# Altium project LimeSDR-USB_1v4.PrjPcb (part 1 of 8)
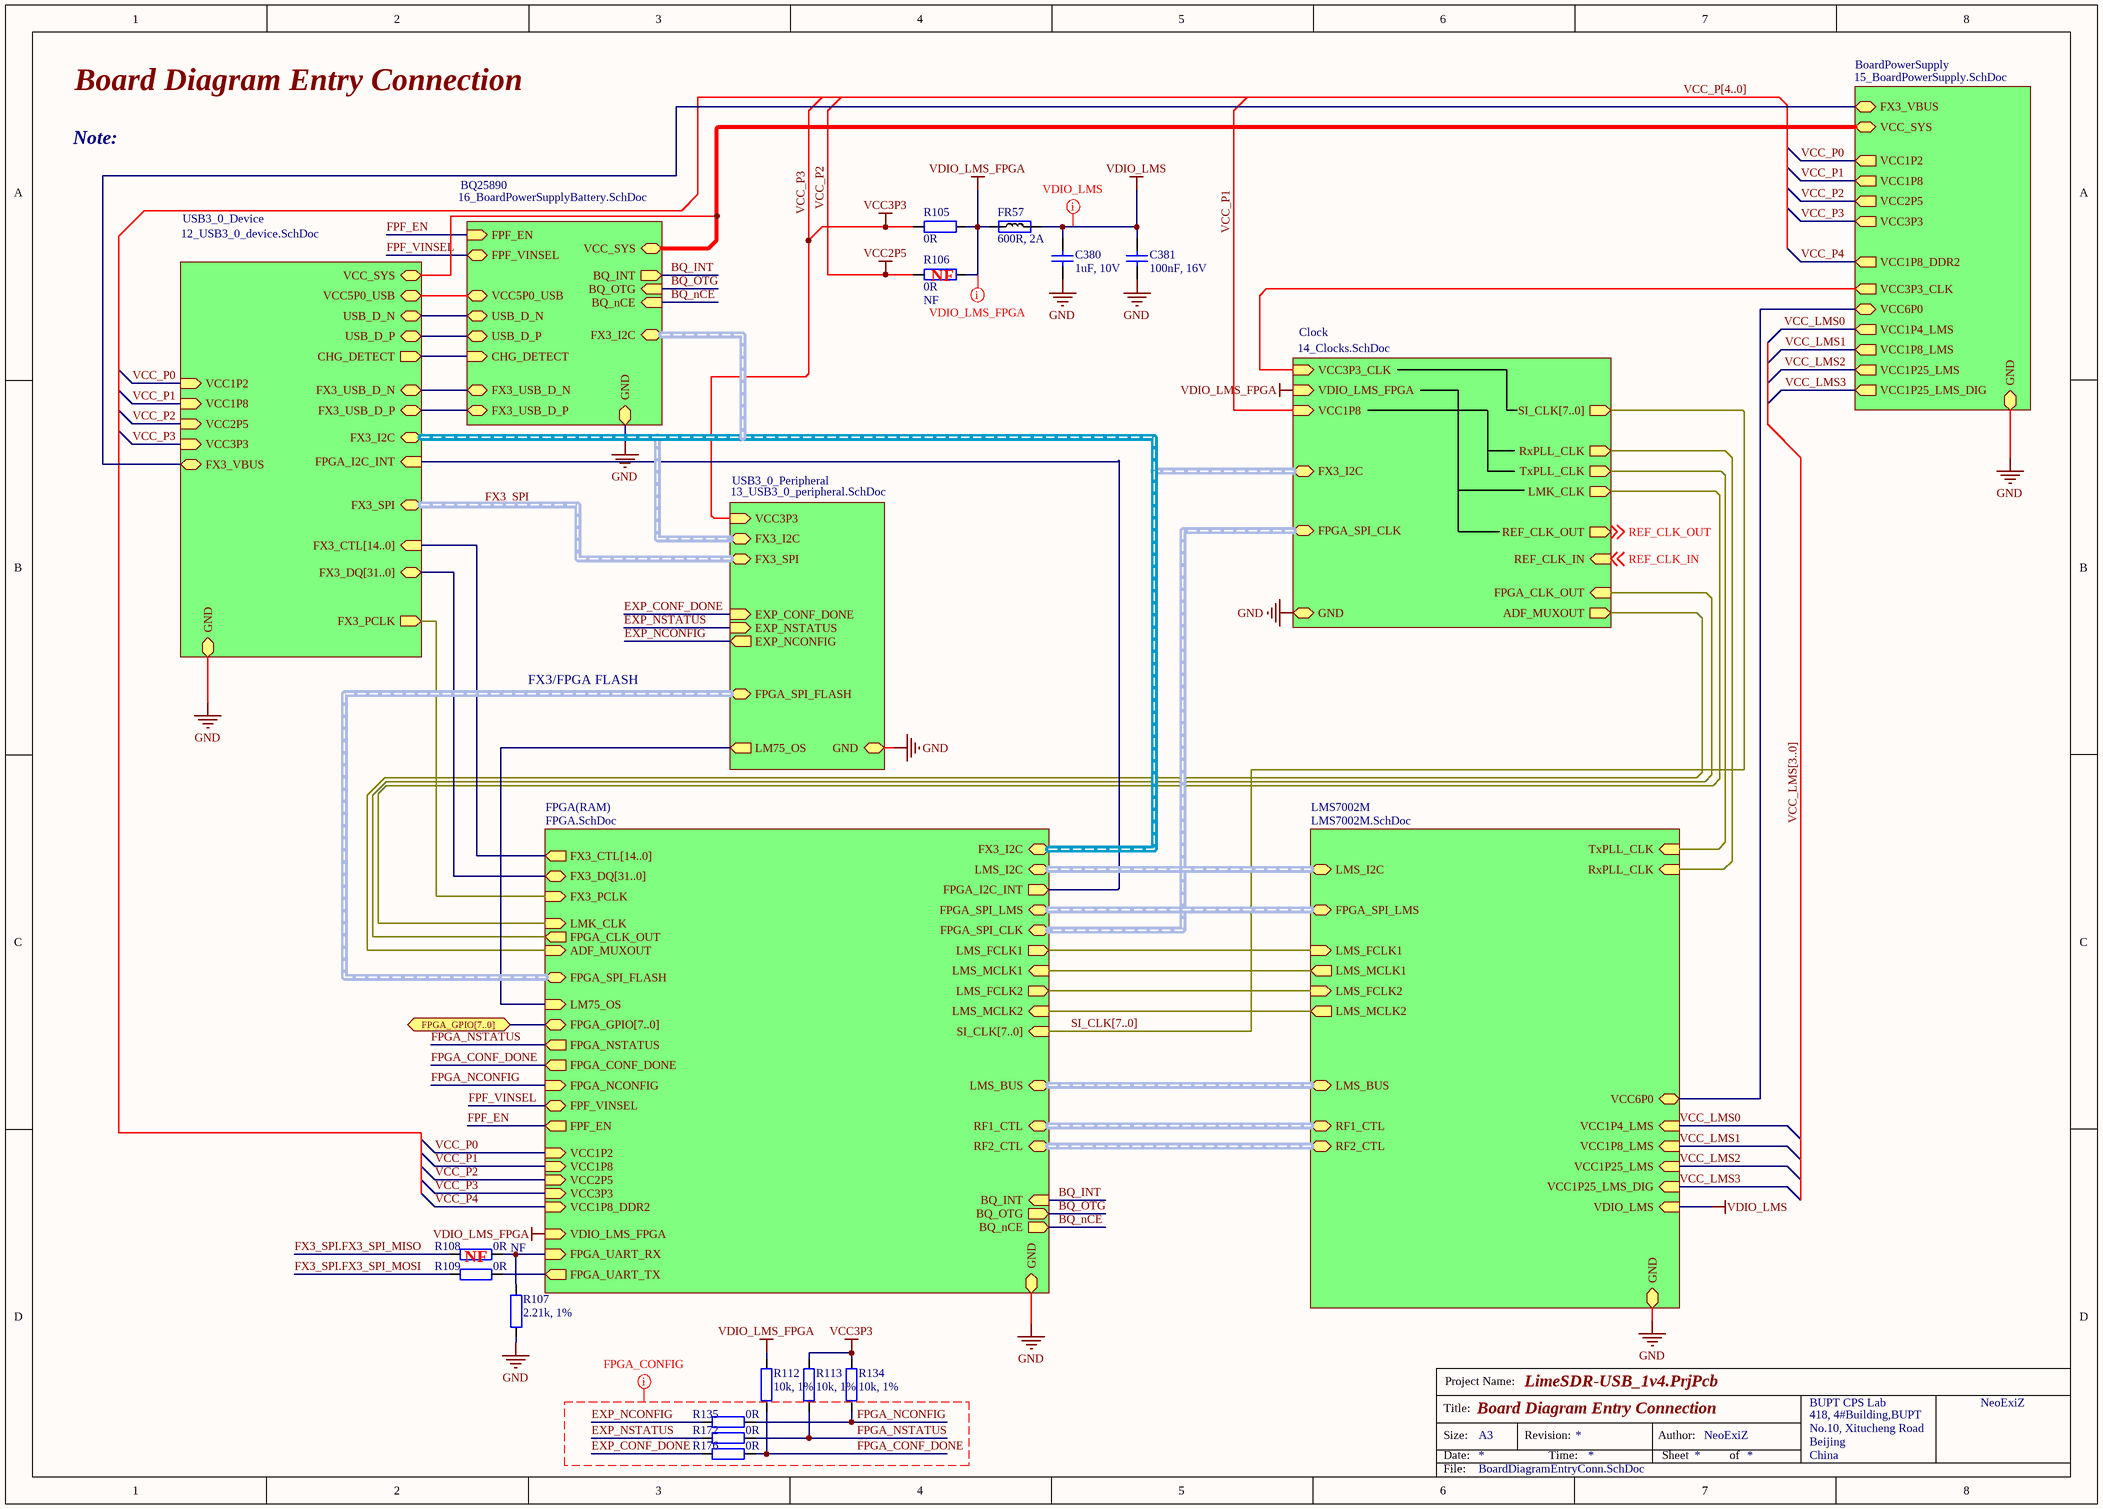
[diagram p0: BoardDiagramEntryConn.SchDoc]
15 sheets, 808 parts. Net scope: strictly hierarchical (ports join the sheet entries above them; power ports are local).
Board files: LimeSDR-USB_1v4.PcbDoc, LimeSDR-USB_1v5.PcbDoc
Sheets:
  BoardDiagramEntryConn.SchDoc
    BoardPowerSupply = 15_BoardPowerSupply.SchDoc
    BQ25890 = 16_BoardPowerSupplyBattery.SchDoc
    Clock = 14_Clocks.SchDoc
    USB3_0_Device = 12_USB3_0_device.SchDoc
    USB3_0_Peripheral = 13_USB3_0_peripheral.SchDoc
    FPGA(RAM) = FPGA.SchDoc
      FPGA_C = 09_FPGA_banks_5_6_7_8.SchDoc
      FPGA_B = 08_FPGA_banks_1_2_3_4.SchDoc
      FPGA_A = 10_FPGA_misc.SchDoc
      DDR2 = 11_DDR2.SchDoc
    LMS7002M = LMS7002M.SchDoc
      LMS7002M_Misc = LMS7002M_Misc.SchDoc
      LMS7002M_RF1 = LMS7002M_RF1.SchDoc
      LMS7002M_RF2 = LMS7002M_RF2.SchDoc

## Sheet BoardDiagramEntryConn.SchDoc: Board Diagram Entry Connection
size A3; Author: NeoExiZ; CompanyName: BUPT CPS Lab; Engineer: NeoExiZ; Organization: NeoExiZ; Address1: 418, 4#Building,BUPT; Address2: No.10, Xitucheng Road; Address3: Beijing; Address4: China

### Parts
C380  1uF, 10V  [CAP0402]
C381  100nF, 16V  [CAP0402]
FR57  600R, 2A  [RES0805]
R105  0R  [RES0402]
R106  0R  Assembly Info: NF  [RES0402]
R107  2.21k, 1%  [RES0402]
R108  0R  Assembly Info: NF  [RES0402]
R109  0R  [RES0402]
R112  10k, 1%  [RES0402]
R113  10k, 1%  [RES0402]
R134  10k, 1%  [RES0402]
R135  0R  [RES0402]
R172  0R  [RES0402]
R176  0R  [RES0402]

### Sub-sheets
BoardPowerSupply = 15_BoardPowerSupply.SchDoc: VCC3P3 (out), VCC2P5 (out), VCC1P2 (out), VCC3P3_CLK (out), VCC1P4_LMS (out), VCC1P8_LMS (out), VCC1P25_LMS (out), VCC1P25_LMS_DIG (out), VCC1P8 (out), VCC1P8_DDR2 (out), VCC_SYS, GND, FX3_VBUS, VCC6P0
BQ25890 = 16_BoardPowerSupplyBattery.SchDoc: VCC5P0_USB, FX3_USB_D_N (bidir), FX3_USB_D_P (bidir), USB_D_N (bidir), USB_D_P (bidir), VCC_SYS, FPF_VINSEL (bidir), GND, BQ_nCE (in), BQ_INT (out), BQ_OTG (in), CHG_DETECT (in), FPF_EN (in), FX3_I2C (harness FX3_I2C)
Clock = 14_Clocks.SchDoc: VDIO_LMS_FPGA (in), VCC3P3_CLK (in), VCC1P8 (in), REF_CLK_IN (in), REF_CLK_OUT (out), SI_CLK[7..0] (out), RxPLL_CLK (out), TxPLL_CLK (out), FPGA_CLK_OUT (in), LMK_CLK (out), ADF_MUXOUT (out), GND, FPGA_SPI_CLK (harness FPGA_SPI_CLK), FX3_I2C (harness FX3_I2C)
FPGA(RAM) = FPGA.SchDoc: SI_CLK[7..0] (in), FX3_DQ[31..0] (bidir), FX3_PCLK (in), FX3_CTL[14..0] (out, harness FX3_SPI), LMS_MCLK1 (in), LMS_MCLK2 (in), FPGA_NSTATUS (out), FPGA_CONF_DONE (out), FPGA_NCONFIG (in), LMS_FCLK1 (out), LMS_FCLK2 (out), FPGA_I2C_INT (out), LMK_CLK (in), FPGA_CLK_OUT (out), LM75_OS (in), FPGA_GPIO[7..0] (bidir), VCC1P2 (in), VCC1P8 (in), VCC3P3 (in), VDIO_LMS_FPGA (in), VCC2P5 (in), FPGA_UART_RX (in), FPGA_UART_TX (out), ADF_MUXOUT (in), VCC1P8_DDR2 (in), FPF_VINSEL (bidir), GND, BQ_INT (in), BQ_OTG (out), BQ_nCE (out), FPF_EN (out), FPGA_SPI_CLK (harness FPGA_SPI_CLK), FX3_I2C (harness FX3_I2C), FPGA_SPI_FLASH (harness FPGA_SPI_FLASH), FPGA_SPI_LMS (harness FPGA_SPI_LMS), LMS_I2C (harness I2C), LMS_BUS (harness LMS_BUS), RF1_CTL (harness RF_CTL), RF2_CTL (harness RF_CTL)
LMS7002M = LMS7002M.SchDoc: FPGA_SPI_LMS (harness FPGA_SPI_LMS), LMS_FCLK1 (in), LMS_FCLK2 (in), LMS_MCLK1 (out), LMS_MCLK2 (out), RxPLL_CLK (in), TxPLL_CLK (in), VCC1P4_LMS (in), VCC1P8_LMS (in), VCC1P25_LMS (in), VCC1P25_LMS_DIG (in), VDIO_LMS (in), GND, LMS_I2C (harness I2C), LMS_BUS (harness LMS_BUS), RF1_CTL (harness RF_CTL), RF2_CTL (harness RF_CTL), VCC6P0
USB3_0_Device = 12_USB3_0_device.SchDoc: VCC1P2 (in), VCC1P8 (in), VCC2P5 (in), VCC3P3 (in), FX3_CTL[14..0] (in, harness FX3_SPI), FX3_DQ[31..0] (bidir), FX3_PCLK (out), FX3_USB_D_N (bidir), FX3_USB_D_P (bidir), VCC5P0_USB, USB_D_N (bidir), USB_D_P (bidir), GND, VCC_SYS, CHG_DETECT (out), FPGA_I2C_INT (in), FX3_I2C (harness FX3_I2C), FX3_SPI (harness FX3_SPI), FX3_VBUS
USB3_0_Peripheral = 13_USB3_0_peripheral.SchDoc: EXP_NCONFIG (out), EXP_NSTATUS (in), EXP_CONF_DONE (in), LM75_OS (out), VCC3P3 (in), GND, FX3_I2C (harness FX3_I2C), FPGA_SPI_FLASH (harness FPGA_SPI_FLASH), FX3_SPI (harness FX3_SPI)

### Ports
FPGA_GPIO[7..0] (bidir)

### Nets
GND: C380.1 C381.2 R107.1 ; sheet BoardPowerSupply/GND, sheet BQ25890/GND, sheet Clock/GND, sheet USB3_0_Device/GND, sheet USB3_0_Peripheral/GND, sheet FPGA(RAM)/GND, sheet LMS7002M/GND
VCC3P3_CLK: sheet BoardPowerSupply/VCC3P3_CLK, sheet Clock/VCC3P3_CLK
VCC5P0_USB: sheet BQ25890/VCC5P0_USB, sheet USB3_0_Device/VCC5P0_USB
VCC6P0: sheet BoardPowerSupply/VCC6P0, sheet LMS7002M/VCC6P0
VCC_LMS1: sheet BoardPowerSupply/VCC1P8_LMS, sheet LMS7002M/VCC1P8_LMS
VCC_P0: sheet BoardPowerSupply/VCC1P2, sheet USB3_0_Device/VCC1P2, sheet FPGA(RAM)/VCC1P2
VCC_P2: R106.2 ; sheet BoardPowerSupply/VCC2P5, sheet USB3_0_Device/VCC2P5, sheet FPGA(RAM)/VCC2P5  [also labelled VCC2P5]
VCC_P3: R105.2 R113.1 R134.1 ; sheet BoardPowerSupply/VCC3P3, sheet USB3_0_Device/VCC3P3, sheet USB3_0_Peripheral/VCC3P3, sheet FPGA(RAM)/VCC3P3  [also labelled VCC3P3]
VCC_SYS: sheet BoardPowerSupply/VCC_SYS, sheet BQ25890/VCC_SYS, sheet USB3_0_Device/VCC_SYS
VDIO_LMS: C380.2 C381.1 FR57.2 ; sheet LMS7002M/VDIO_LMS
VDIO_LMS_FPGA: FR57.1 R105.1 R106.1 R112.1 ; sheet Clock/VDIO_LMS_FPGA, sheet FPGA(RAM)/VDIO_LMS_FPGA
BQ_INT: sheet BQ25890/BQ_INT, sheet FPGA(RAM)/BQ_INT
BQ_nCE: sheet BQ25890/BQ_nCE, sheet BQ25890/CHG_DETECT, sheet USB3_0_Device/CHG_DETECT, sheet FPGA(RAM)/BQ_nCE
BQ_OTG: sheet BQ25890/BQ_OTG, sheet FPGA(RAM)/BQ_OTG
EXP_CONF_DONE: R176.1 ; sheet USB3_0_Peripheral/EXP_CONF_DONE
EXP_NCONFIG: R135.1 ; sheet USB3_0_Peripheral/EXP_NCONFIG
EXP_NSTATUS: R172.1 ; sheet USB3_0_Peripheral/EXP_NSTATUS
FPF_EN: sheet BQ25890/FPF_EN, sheet FPGA(RAM)/FPF_EN
FPF_VINSEL: sheet BQ25890/FPF_VINSEL, sheet FPGA(RAM)/FPF_VINSEL
FPGA_CONF_DONE: R112.2 R176.2 ; sheet FPGA(RAM)/FPGA_CONF_DONE
FPGA_NCONFIG: R134.2 R135.2 ; sheet FPGA(RAM)/FPGA_NCONFIG
FPGA_NSTATUS: R113.2 R172.2 ; sheet FPGA(RAM)/FPGA_NSTATUS
FX3_PCLK: sheet USB3_0_Device/FX3_PCLK, sheet FPGA(RAM)/FX3_PCLK
FX3_SPI.FX3_SPI_MISO: R108.1
FX3_SPI.FX3_SPI_MOSI: R109.1
FX3_USB_D_N: sheet BQ25890/FX3_USB_D_N, sheet USB3_0_Device/FX3_USB_D_N
FX3_USB_D_P: sheet BQ25890/FX3_USB_D_P, sheet USB3_0_Device/FX3_USB_D_P
FX3_VBUS: sheet BoardPowerSupply/FX3_VBUS, sheet USB3_0_Device/FX3_VBUS
LM75_OS: sheet USB3_0_Peripheral/LM75_OS, sheet FPGA(RAM)/LM75_OS
LMK_CLK: sheet Clock/LMK_CLK, sheet FPGA(RAM)/LMK_CLK
LMS_FCLK1: sheet FPGA(RAM)/LMS_FCLK1, sheet LMS7002M/LMS_FCLK1
LMS_FCLK2: sheet FPGA(RAM)/LMS_FCLK2, sheet LMS7002M/LMS_FCLK2
LMS_MCLK1: sheet FPGA(RAM)/LMS_MCLK1, sheet LMS7002M/LMS_MCLK1
LMS_MCLK2: sheet FPGA(RAM)/LMS_MCLK2, sheet LMS7002M/LMS_MCLK2
REF_CLK_IN: off-sheet REF_CLK_IN, sheet Clock/REF_CLK_IN
REF_CLK_OUT: off-sheet REF_CLK_OUT, sheet Clock/REF_CLK_OUT
RxPLL_CLK: sheet Clock/RxPLL_CLK, sheet LMS7002M/RxPLL_CLK
TxPLL_CLK: sheet Clock/TxPLL_CLK, sheet LMS7002M/TxPLL_CLK
USB_D_N: sheet BQ25890/USB_D_N, sheet USB3_0_Device/USB_D_N
USB_D_P: sheet BQ25890/USB_D_P, sheet USB3_0_Device/USB_D_P
VCC_LMS0: sheet BoardPowerSupply/VCC1P4_LMS, sheet LMS7002M/VCC1P4_LMS
VCC_LMS2: sheet BoardPowerSupply/VCC1P25_LMS, sheet LMS7002M/VCC1P25_LMS
VCC_LMS3: sheet BoardPowerSupply/VCC1P25_LMS_DIG, sheet LMS7002M/VCC1P25_LMS_DIG
VCC_P1: sheet BoardPowerSupply/VCC1P8, sheet Clock/VCC1P8, sheet USB3_0_Device/VCC1P8, sheet FPGA(RAM)/VCC1P8  [project net VCC1P8]
VCC_P4: sheet BoardPowerSupply/VCC1P8_DDR2, sheet FPGA(RAM)/VCC1P8_DDR2
NetIC8_C2: sheet Clock/FPGA_CLK_OUT, sheet FPGA(RAM)/FPGA_CLK_OUT
NetIC8_J1: R107.2 R108.2 ; sheet FPGA(RAM)/FPGA_UART_RX
NetIC8_J2: sheet Clock/ADF_MUXOUT, sheet FPGA(RAM)/ADF_MUXOUT
NetIC8_J8: R109.2 ; sheet FPGA(RAM)/FPGA_UART_TX
NetIC8_R1: sheet USB3_0_Device/FPGA_I2C_INT, sheet FPGA(RAM)/FPGA_I2C_INT

### Buses and harness runs
bus port FPGA_GPIO[7..0] = sheet FPGA(RAM)/FPGA_GPIO[7..0]
bus sheet FPGA(RAM)/FX3_DQ[31..0] = sheet USB3_0_Device/FX3_DQ[31..0]
bus SI_CLK[7..0] = sheet Clock/SI_CLK[7..0] = sheet FPGA(RAM)/SI_CLK[7..0]
bus VCC_LMS[3..0]
bus VCC_P[4..0]
harness FX3_SPI = sheet USB3_0_Device/FX3_SPI = sheet USB3_0_Peripheral/FX3_SPI
harness sheet BQ25890/FX3_I2C = sheet Clock/FX3_I2C = sheet FPGA(RAM)/FX3_I2C = sheet USB3_0_Device/FX3_I2C = sheet USB3_0_Peripheral/FX3_I2C
harness sheet Clock/FPGA_SPI_CLK = sheet FPGA(RAM)/FPGA_SPI_CLK
harness sheet FPGA(RAM)/FPGA_SPI_FLASH = sheet USB3_0_Peripheral/FPGA_SPI_FLASH
harness sheet FPGA(RAM)/FPGA_SPI_LMS = sheet LMS7002M/FPGA_SPI_LMS
harness sheet FPGA(RAM)/LMS_BUS = sheet LMS7002M/LMS_BUS
harness sheet FPGA(RAM)/LMS_I2C = sheet LMS7002M/LMS_I2C
harness sheet FPGA(RAM)/RF1_CTL = sheet LMS7002M/RF1_CTL
harness sheet FPGA(RAM)/RF2_CTL = sheet LMS7002M/RF2_CTL

### Layout directives
net class FPGA_CONFIG: EXP_CONF_DONE, EXP_NCONFIG, EXP_NSTATUS, FPGA_CONF_DONE, FPGA_NCONFIG, FPGA_NSTATUS
net class VDIO_LMS: VDIO_LMS
net class VDIO_LMS_FPGA: VDIO_LMS_FPGA

### Notes on the sheet
- (near R106) NF
- FX3/FPGA FLASH
- (near R108) NF
- Note:
- Project Name:
- Size:
- Date:
- Title:
- A3
- Revision:
- Time:
- Author:
- Sheet
- of
- File:

### Library data of the parts
C380 = Cap_0402: Manufacturer Part Number 1: GRM155R61A105KE15J; Manufacturer: TDK; Part Description: 1µF ±10% 10V X5R Ceramic Capacitor -55°C ~ 85°C Surface Mount, MLCC 0402 (1005 Metric) 0.039" L x 0.020" W (1.00mm x 0.50mm); Voltage Rating: 10; Capacitance Tolerance: ± 10%; Product Range: TDK - C Series; Ceramic Capacitor Case: 0402 [1005 Metric]; Capacitance: 1; Dielectric Characteristic: X6; Value: 1uF, 10V; Supplier 1: Newark; Supplier Part Number 1: 490-6298-2-ND; MSL: -; RoHS: YES
C381 = Cap_0402: Manufacturer: Murata Electronics; Manufacturer Part Number: GRM155R71C104KA88D; Part Description: 0.10µF ±10% 16V X7R Ceramic Capacitor -55°C ~ 125°C Surface Mount, MLCC 0402 (1005 Metric) 0.039" L x 0.020" W (1.00mm x 0.50mm); Tolerance: 10 %; Type: General Purpose MLCC; Capacitance: 0.1 uF; Case Length: 1 mm; Dielectric: X7R; Case Height: 0.5 mm; Temperature Coefficient / Code: +/- 15 %; Value: 100nF, 16V; Supplier 1: Mouser; Supplier Part Number 1: 81-GRM155R71C104KA88; Case Code - in: 0402; RoHS: RoHS Compliant; Operating Temperature Range: - 55 C to + 125 C; Series: GRM; Termination Style: SMD/SMT; Package / Case: 0402 (1005 metric); Voltage Rating DC: 16 V; Maximum Operating Temperature: + 125 C; Case Code - mm: 1005; Minimum Operating Temperature: - 55 C; Product Category: Low & Medium Capacitance SMD Ceramic Chip Capacitors; Packaging: Reel; Product: General Type MLCCs; Category: Multilayer Ceramic Capacitors MLCC - SMD/SMT; Brand: Murata Electronics; Case Width: 0.5 mm; RoHS - Mouser: Y; Standard Pack Qty: 10000; Minimum Order Quantity: 1; Reeling: True; Manufacturer Part Number 1: GRM155R71C104KA88D
FR57 = Ferrite: Manufacturer Part Number 1: MPZ2012S601AT000; Manufacturer: TDK Corporation; Part Description: FERRITE BEAD 600 OHM 0805 1LN; Filter Type: Differential Mode - Single; Impedance @ Frequency: 600 Ohm @ 100MHz; DC Resistance (DCR): 100 mOhm Max; Supplier 1: Digi-Key; Supplier Part Number 1: 445-2206-2-ND; Mounting Type: Surface Mount; RoHS: RoHS Compliant; Height (Max): 0.041" (1.05mm); Packaging: Tape & Reel (TR); Category: Filters; Current Rating: 2A; Package / Case: 0805 (2012 Metric); Size / Dimension: 0.079" L x 0.049" W (2.00mm x 1.25mm); Value: 600R, 2A
R105 R106 = Res_0402: Manufacturer Part Number 1: RC0402JR-070RL; Manufacturer: Yageo; Part Description: RES SMD 0.0OHM JUMPER 1/16W 0402; Resistance (Ohms): 0.0; Tolerance: Jumper; Power (Watts): 0.063W, 1/16W; Value: 0R; Supplier 1: Digi-Key; Supplier Part Number 1: 311-0.0JRTR-ND; Category: Resistors; Temperature Coefficient: -; Features: Moisture Resistant; Supplier Device Package: 0402; Height: 0.016" (0.40mm); Package / Case: 0402 (1005 Metric); Operating Temperature: -55°C ~ 155°C; Size / Dimension: 0.039" L x 0.020" W (1.00mm x 0.50mm); Composition: Thick Film; Packaging: Tape & Reel (TR); Number of Terminations: 2; RoHS: RoHS Compliant
R107 = Res_0402: Manufacturer: Stackpole Electronics Inc.; Manufacturer Part Number 1: RMCF0402FT2K21; Part Description: RES SMD 2.21K OHM 1% 1/16W 0402; Power (Watts): 0.063W, 1/16W; Temperature Coefficient: ±100ppm/°C; Value: 2.21k, 1%; Supplier 1: Digi-Key; Supplier Part Number 1: RMCF0402FT2K21CT-ND; Operating Temperature: -55°C ~ 155°C; Height: 0.016" (0.40mm); Tolerance: ±1%; Resistance (Ohms): 2.21k; Features: Automotive AEC-Q200; Package / Case: 0402 (1005 Metric); Packaging: Cut Tape (CT); Composition: Thick Film; Category: Resistors; Supplier Device Package: 0402; Number of Terminations: 2; RoHS: RoHS Compliant; Size / Dimension: 0.039" L x 0.020" W (1.00mm x 0.50mm)
R108 R109 R135 R172 R176 = Res_0402: Manufacturer: Yageo; Part Description: RES SMD 0.0OHM JUMPER 1/16W 0402; Supplier 1: Digi-Key; Supplier Part Number 1: 311-0.0JRTR-ND; Composition: Thick Film; Package / Case: 0402 (1005 Metric); Category: Resistors; Value: 0R
R112 R113 R134 = Res_0402: Manufacturer: Yageo; Manufacturer Part Number 1: RC0402FR-0710KL; Part Description: RES SMD 10K OHM 1% 1/16W 0402; Temperature Coefficient: ±100ppm/°C; Power (Watts): 0.063W, 1/16W; Value: 10k, 1%; Supplier 1: Digi-Key; Supplier Part Number 1: 311-10.0KLRTR-ND; Resistance (Ohms): 10k; Packaging: Tape & Reel (TR); RoHS: RoHS Compliant; Package / Case: 0402 (1005 Metric); Tolerance: ±1%; Operating Temperature: -55°C ~ 155°C; Size / Dimension: 0.039" L x 0.020" W (1.00mm x 0.50mm); Number of Terminations: 2; Category: Resistors; Height: 0.016" (0.40mm); Supplier Device Package: 0402; Features: Moisture Resistant; Composition: Thick Film

## Sheet 15_BoardPowerSupply.SchDoc: Board power supply
size A3; Organization: Lime Microsystems; Address1: Surrey Tech Centre; Address2: Guildford GU2 7YG; Address3: Surrey; Address4: United Kingdom; Revision: v1.4; SheetNumber: 15; SheetTotal: 15
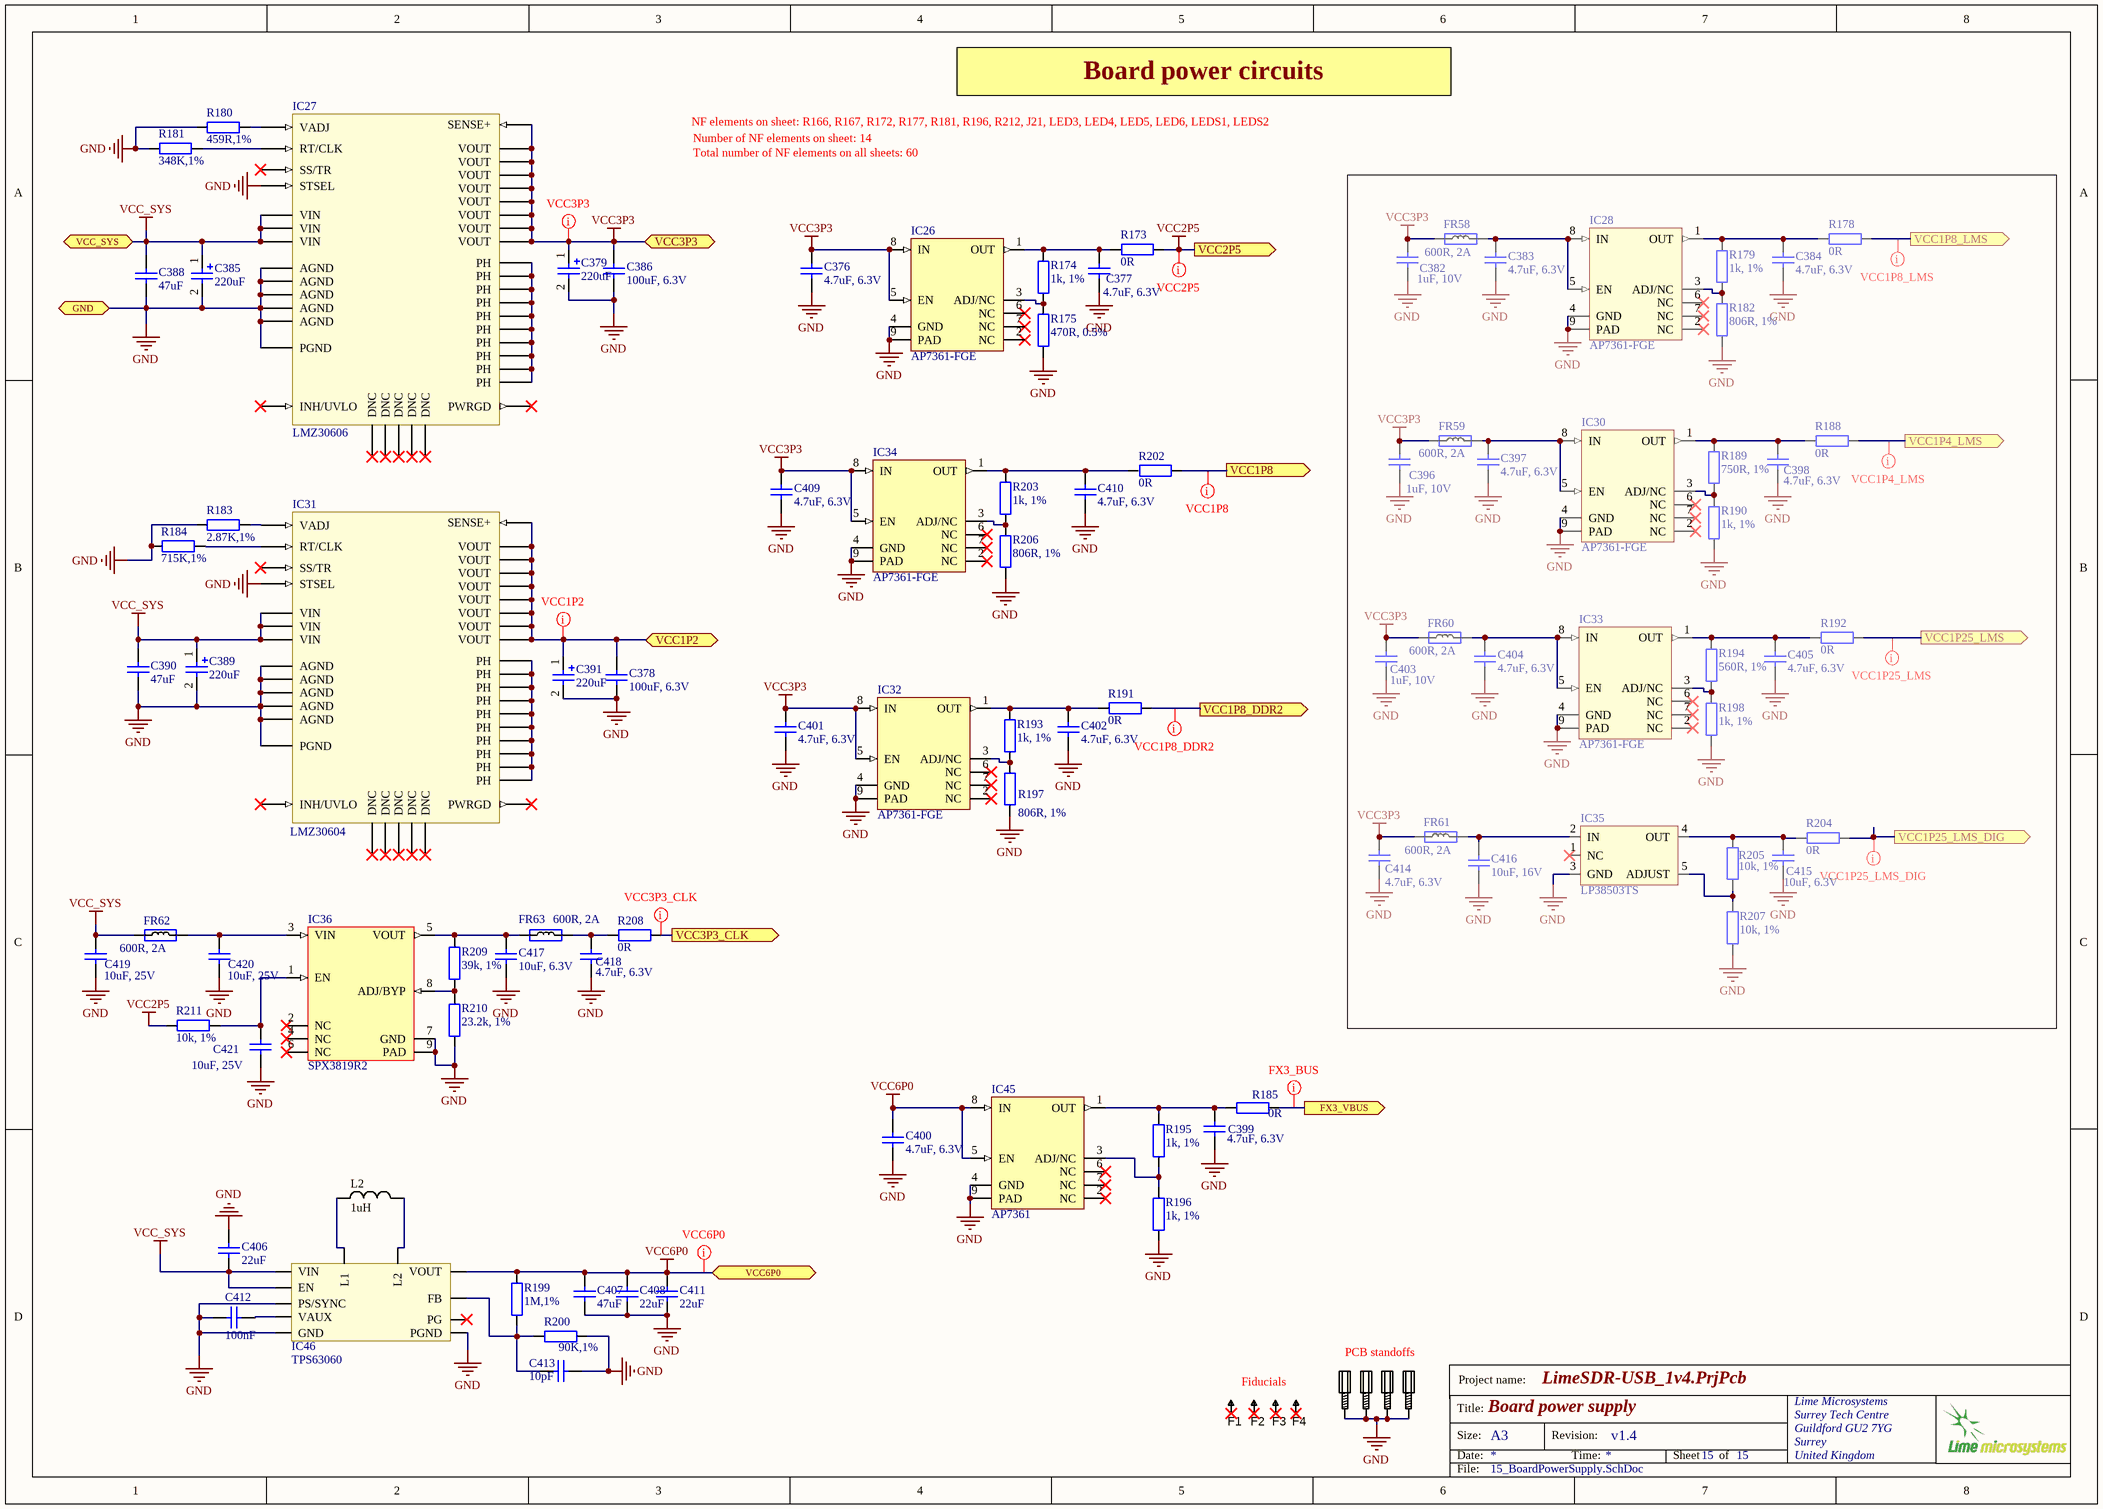
[diagram p1: 15_BoardPowerSupply.SchDoc]

### Parts
C376  4.7uF, 6.3V  [CAP0402]
C377  4.7uF, 6.3V  [CAP0402]
C378  100uF, 6.3V  [CAP1206]
C379  220uF
C382  1uF, 10V  [CAP0402]
C383  4.7uF, 6.3V  [CAP0402]
C384  4.7uF, 6.3V  [CAP0402]
C385  220uF
C386  100uF, 6.3V  [CAP1206]
C388  47uF  [CAP1206]
C389  220uF
C390  47uF  [CAP1206]
C391  220uF
C396  1uF, 10V  [CAP0402]
C397  4.7uF, 6.3V  [CAP0402]
C398  4.7uF, 6.3V  [CAP0402]
C399  4.7uF, 6.3V  [CAP0402]
C400  4.7uF, 6.3V  [CAP0402]
C401  4.7uF, 6.3V  [CAP0402]
C402  4.7uF, 6.3V  [CAP0402]
C403  1uF, 10V  [CAP0402]
C404  4.7uF, 6.3V  [CAP0402]
C405  4.7uF, 6.3V  [CAP0402]
C406  22uF  [CAP1206]
C407  47uF  [CAP1206]
C408  22uF  [CAP1206]
C409  4.7uF, 6.3V  [CAP0402]
C410  4.7uF, 6.3V  [CAP0402]
C411  22uF  [CAP1206]
C412  100nF  [CAP0603]
C413  10pF  [CAP0603]
C414  4.7uF, 6.3V  [CAP0402]
C415  10uF, 6.3V  [CAP0603]
C416  10uF, 16V  [CAP0603]
C417  10uF, 6.3V  [CAP0603]
C418  4.7uF, 6.3V  [CAP0402]
C419  10uF, 25V  [CAP0603]
C420  10uF, 25V  [CAP0603]
C421  10uF, 25V  [CAP0603]
F1  Fiducial  [Fiducial]  (value not drawn)
F2  Fiducial  [Fiducial]  (value not drawn)
F3  Fiducial  [Fiducial]  (value not drawn)
F4  Fiducial  [Fiducial]  (value not drawn)
FR58  600R, 2A  [RES0805]
FR59  600R, 2A  [RES0805]
FR60  600R, 2A  [RES0805]
FR61  600R, 2A  [RES0805]
FR62  600R, 2A  [RES0805]
FR63  600R, 2A  [RES0805]
IC26  AP7361-FGE  [AP7361]
IC27  LMZ30606  [QFN-LMZ306xx]
IC28  AP7361-FGE  [AP7361]
IC30  AP7361-FGE  [AP7361]
IC31  LMZ30604  [QFN-LMZ306xx]
IC32  AP7361-FGE  [AP7361]
IC33  AP7361-FGE  [AP7361]
IC34  AP7361-FGE  [AP7361]
IC35  LP38503TS  [TO-263-5_v2]
IC36  SPX3819R2  [SPX3819R2-L/TR]
IC45  AP7361  [AP7361]
IC46  TPS63060  [SON-10]
L2  1uH  [FDVE1040_TOKO_INDUCTOR]
MECH1  # pcs.  [PCB_standoff]  (value not drawn)
MECH2  # pcs.  [PCB_standoff]  (value not drawn)
MECH3  # pcs.  [PCB_standoff]  (value not drawn)
MECH4  # pcs.  [PCB_standoff]  (value not drawn)
R173  0R  [RES0402]
R174  1k, 1%  [RES0402]
R175  470R, 0.5%  [RES0402]
R178  0R  [RES0402]
R179  1k, 1%  [RES0402]
R180  459R,1%  [RES0402]
R181  348K,1%  [RES0402]
R182  806R, 1%  [RES0402]
R183  2.87K,1%  [RES0402]
R184  715K,1%  [RES0402]
R185  0R  [RES0402]
R188  0R  [RES0402]
R189  750R, 1%  [RES0402]
R190  1k, 1%  [RES0402]
R191  0R  [RES0402]
R192  0R  [RES0402]
R193  1k, 1%  [RES0402]
R194  560R, 1%  [RES0402]
R195  1k, 1%  [RES0402]
R196  1k, 1%  [RES0402]
R197  806R, 1%  [RES0402]
R198  1k, 1%  [RES0402]
R199  1M,1%  [RES0402]
R200  90K,1%  [RES0402]
R202  0R  [RES0402]
R203  1k, 1%  [RES0402]
R204  0R  [RES0402]
R205  10k, 1%  [RES0402]
R206  806R, 1%  [RES0402]
R207  10k, 1%  [RES0402]
R208  0R  [RES0402]
R209  39k, 1%  [RES0402]
R210  23.2k, 1%  [RES0402]
R211  10k, 1%  [RES0402]

### Ports
FX3_VBUS (out), GND, VCC1P2, VCC1P4_LMS (out), VCC1P8 (out), VCC1P8_DDR2 (out), VCC1P8_LMS (out), VCC1P25_LMS (out), VCC1P25_LMS_DIG (out), VCC2P5 (out), VCC3P3, VCC3P3_CLK (out), VCC6P0, VCC_SYS

### Nets
GND: C376.1 C377.1 C378.1 C379.2 C382.1 C383.1 C384.1 C385.2 C386.1 C388.1 C389.2 C390.1 C391.2 C396.1 C397.1 C398.1 C399.1 C400.1 C401.1 C402.1 C403.1 C404.1 C405.1 C406.2 C407.1 C408.1 C409.1 C410.1 C411.1 C412.1 C413.2 C414.1 C415.1 C416.1 C417.1 C418.1 C419.1 C420.1 C421.1 IC26.4(GND) IC26.9(PAD) IC27.1(AGND) IC27.5(AGND) IC27.7(STSEL) IC27.29(AGND) IC27.33(AGND) IC27.34(AGND) IC27.37(PGND) IC28.4(GND) IC28.9(PAD) IC30.4(GND) IC30.9(PAD) IC31.1(AGND) IC31.5(AGND) IC31.7(STSEL) IC31.29(AGND) IC31.33(AGND) IC31.34(AGND) IC31.37(PGND) IC32.4(GND) IC32.9(PAD) IC33.4(GND) IC33.9(PAD) IC34.4(GND) IC34.9(PAD) IC35.3(GND) IC36.7(GND) IC36.9(PAD) IC45.4(GND) IC45.9(PAD) IC46.4(PS/SYNC) IC46.7(GND) IC46.pp(PGND) MECH1.MH1 MECH2.MH1 MECH3.MH1 MECH4.MH1 R175.2 R180.1 R181.1 R182.2 R183.1 R184.1 R190.1 R196.1 R197.2 R198.1 R200.1 R206.2 R207.2 R210.1 ; port GND
VCC2P5: R173.1 R211.1 ; port VCC2P5  [project net VCC_P2]
VCC3P3: C376.2 C379.1 C382.2 C386.2 C396.2 C401.2 C403.2 C409.2 C414.2 FR58.1 FR59.1 FR60.1 FR61.1 IC26.5(EN) IC26.8(IN) IC27.8(VOUT) IC27.9(VOUT) IC27.10(VOUT) IC27.11(VOUT) IC27.12(VOUT) IC27.13(VOUT) IC27.14(VOUT) IC27.36(SENSE+) IC27.38(VOUT) IC32.5(EN) IC32.8(IN) IC34.5(EN) IC34.8(IN) ; port VCC3P3  [project net VCC_P3]
VCC3P3_CLK: R208.1 ; port VCC3P3_CLK
VCC6P0: C400.2 C407.2 C408.2 C411.2 IC45.5(EN) IC45.8(IN) IC46.9(VOUT) R199.2 ; port VCC6P0
VCC_LMS1: R178.1 ; port VCC1P8_LMS
VCC_P0: C378.2 C391.1 IC31.8(VOUT) IC31.9(VOUT) IC31.10(VOUT) IC31.11(VOUT) IC31.12(VOUT) IC31.13(VOUT) IC31.14(VOUT) IC31.36(SENSE+) IC31.38(VOUT) ; port VCC1P2
VCC_SYS: C385.1 C388.2 C389.1 C390.2 C406.1 C419.2 FR62.1 IC27.30(VIN) IC27.31(VIN) IC27.32(VIN) IC31.30(VIN) IC31.31(VIN) IC31.32(VIN) IC46.2(VIN) IC46.3(EN) ; port VCC_SYS
FX3_VBUS: R185.1 ; port FX3_VBUS
VCC1P8: R202.1 ; port VCC1P8
VCC_LMS0: R188.1 ; port VCC1P4_LMS
VCC_LMS2: R192.1 ; port VCC1P25_LMS
VCC_LMS3: R204.1 ; port VCC1P25_LMS_DIG
VCC_P4: R191.1 ; port VCC1P8_DDR2
NetC377_2: C377.2 IC26.1(OUT) R173.2 R174.2
NetC383_2: C383.2 FR58.2 IC28.5(EN) IC28.8(IN)
NetC384_2: C384.2 IC28.1(OUT) R178.2 R179.2
NetC397_2: C397.2 FR59.2 IC30.5(EN) IC30.8(IN)
NetC398_2: C398.2 IC30.1(OUT) R188.2 R189.1
NetC399_2: C399.2 IC45.1(OUT) R185.2 R195.2
NetC402_2: C402.2 IC32.1(OUT) R191.2 R193.2
NetC404_2: C404.2 FR60.2 IC33.5(EN) IC33.8(IN)
NetC405_2: C405.2 IC33.1(OUT) R192.2 R194.2
NetC410_2: C410.2 IC34.1(OUT) R202.2 R203.2
NetC412_2: C412.2 IC46.6(VAUX)
NetC413_1: C413.1 IC46.8(FB) R199.1 R200.2
NetC415_2: C415.2 IC35.4(OUT) R204.2 R205.1
NetC416_2: C416.2 FR61.2 IC35.2(IN)
NetC417_2: C417.2 FR63.1 IC36.5(VOUT) R209.1
NetC418_2: C418.2 FR63.2 R208.2
NetC420_2: C420.2 FR62.2 IC36.3(VIN)
NetC421_2: C421.2 IC36.1(EN) R211.2
NetIC26_3: IC26.3(ADJ/NC) R174.1 R175.1
NetIC27_4: IC27.4(RT/CLK) R181.2
NetIC27_17: IC27.17(PH) IC27.18(PH) IC27.19(PH) IC27.20(PH) IC27.21(PH) IC27.22(PH) IC27.23(PH) IC27.24(PH) IC27.25(PH) IC27.39(PH)
NetIC27_35: IC27.35(VADJ) R180.2
NetIC28_3: IC28.3(ADJ/NC) R179.1 R182.1
NetIC30_3: IC30.3(ADJ/NC) R189.2 R190.2
NetIC31_4: IC31.4(RT/CLK) R184.2
NetIC31_17: IC31.17(PH) IC31.18(PH) IC31.19(PH) IC31.20(PH) IC31.21(PH) IC31.22(PH) IC31.23(PH) IC31.24(PH) IC31.25(PH) IC31.39(PH)
NetIC31_35: IC31.35(VADJ) R183.2
NetIC32_3: IC32.3(ADJ/NC) R193.1 R197.1
NetIC33_3: IC33.3(ADJ/NC) R194.1 R198.2
NetIC34_3: IC34.3(ADJ/NC) R203.1 R206.1
NetIC35_5: IC35.5(ADJUST) R205.2 R207.1
NetIC36_8: IC36.8(ADJ/BYP) R209.2 R210.2
NetIC45_3: IC45.3(ADJ/NC) R195.1 R196.2
NetIC46_1: IC46.1(L1) L2.1
NetIC46_10: IC46.10(L2) L2.2

Not connected (* = marked no-connect by the designer): F1 1*; F2 1*; F3 1*; F4 1*; IC26 2(NC)* 6(NC)* 7(NC)*; IC27 2(DNC)* 3(DNC)* 6(SS/TR)* 15(DNC)* 16(DNC)* 26(DNC)* 27(PWRGD)* 28(INH/UVLO)*; IC28 2(NC)* 6(NC)* 7(NC)*; IC30 2(NC)* 6(NC)* 7(NC)*; IC31 2(DNC)* 3(DNC)* 6(SS/TR)* 15(DNC)* 16(DNC)* 26(DNC)* 27(PWRGD)* 28(INH/UVLO)*; IC32 2(NC)* 6(NC)* 7(NC)*; IC33 2(NC)* 6(NC)* 7(NC)*; IC34 2(NC)* 6(NC)* 7(NC)*; IC35 1(NC)*; IC36 2(NC)* 4(NC)* 6(NC)*; IC45 2(NC)* 6(NC)* 7(NC)*; IC46 5(PG)*

### Layout directives
net class VCC2P5: VCC_P2
net class VCC1P8_LMS: VCC_LMS1
net class VCC1P4_LMS: VCC_LMS0
net class VCC1P25_LMS: VCC_LMS2
net class VCC1P25_LMS_DIG: VCC_LMS3
net class VCC1P8_DDR2: VCC_P4
net class VCC1P8: VCC1P8
net class VCC3P3_CLK: FX3_VBUS, VCC3P3_CLK
net class VCC1P2: VCC_P0
net class VCC3P3: VCC_P3
net class VCC6P0: VCC6P0

### Notes on the sheet
- Board power circuits
- NF elements on sheet: R166, R167, R172, R177, R181, R196, R212, J21, LED3, LED4, LED5, LED6, LEDS1, LEDS2
- Number of NF elements on sheet: 14
- Total number of NF elements on all sheets: 60
- Fiducials
- PCB standoffs
- Project name:
- Title:
- Size:
- Date:
- A3
- Revision:
- Time:
- Sheet
- of
- File:

### Library data of the parts
C376 C377 C383 C384 C397-C402 C404 C405 C409 C410 C414 C418 = Cap_0402: Manufacturer: Murata Electronics North America; Manufacturer Part Number: GRM155R60J475ME87D; Part Description: 4.7µF ±20% 6.3V X5R Ceramic Capacitor -55°C ~ 85°C Surface Mount, MLCC 0402 (1005 Metric) 0.039" L x 0.020" W (1.00mm x 0.50mm); Tolerance: ±20%; Capacitance: 4.7µF; Temperature Coefficient: X5R; Lead Style: -; Ratings: -; Height - Seated (Max): -; Thickness (Max): 0.022" (0.55mm); Voltage - Rated: 6.3V; Packaging: Cut Tape (CT); Lead Spacing: -; Category: Capacitors; Supplier Part Number 1: 490-5408-1-ND; Applications: General Purpose; Operating Temperature: -55°C ~ 85°C; Mounting Type: Surface Mount, MLCC; Features: Derating Recommended; RoHS: RoHS Compliant; Supplier 1: Digi-Key; Package / Case: 0402 (1005 Metric); Size / Dimension: 0.039" L x 0.020" W (1.00mm x 0.50mm); Value: 4.7uF, 6.3V
C378 C386 = Cap_1206: Manufacturer Part Number 1: GRM31CR60J107ME39L.; Part Description: 100µF ±20% 6.3V X5R Ceramic Capacitor -55°C ~ 85°C Surface Mount, MLCC 1206 (3216 Metric) 0.126" L x 0.063" W (3.20mm x 1.60mm); Manufacturer: Murata Electronics North America; Capacitance Tolerance: ± 20%; Ceramic Capacitor Case: 1206 [3216 Metric]; Voltage Rating: 6.3; value: 100uF, 6.3V; Supplier Part Number 1: 1735535; Supplier 1: Farnell
C379 C385 C389 C391 = Cap_pol_1206: Value: 220uF
C382 C396 C403 = Cap_0402: as C380 on sheet BoardDiagramEntryConn; Value: 1uF, 10V; Supplier 1: Newark; Supplier Part Number 1: 490-6298-2-ND; MSL: -; RoHS: YES
C388 C406-C408 C411 = Cap_1206: Value: *
C390 = Cap_1206: Manufacturer Part Number 1: GRM31CR60J107ME39L.; Part Description: 100µF ±20% 6.3V X5R Ceramic Capacitor -55°C ~ 85°C Surface Mount, MLCC 1206 (3216 Metric) 0.126" L x 0.063" W (3.20mm x 1.60mm); Manufacturer: Murata Electronics North America; Capacitance Tolerance: ± 20%; Ceramic Capacitor Case: 1206 [3216 Metric]; Voltage Rating: 6.3; value: 100uF, 6.3V; Supplier Part Number 1: 1735535; Supplier 1: Farnell
C412 C413 = Cap_0603: Value: *
C415 C417 = Cap_0603: Manufacturer Part Number 1: CC0603MRX5R5BB106; Part Description: 10µF ±20% 6.3V X5R Ceramic Capacitor -55°C ~ 85°C Surface Mount, MLCC 0603 (1608 Metric) 0.063" L x 0.031" W (1.60mm x 0.80mm); Manufacturer: Yageo; Capacitance: 10µF; Tolerance: ±20%; Supplier 1: Digi-Key; Supplier Part Number 1: 311-1448-2-ND; Package / Case: 0603 (1608 Metric); Category: Capacitors; Voltage - Rated: 6.3V; Value: 10uF, 6.3V
C416 = Cap_0603: Manufacturer: Yageo; Manufacturer Part Number 1: GRM188R61C106MA73D; Part Description: 10µF ±20% 16V X5R Ceramic Capacitor -55°C ~ 85°C Surface Mount, MLCC 0603 (1608 Metric) 0.063" L x 0.031" W (1.60mm x 0.80mm); Temperature Coefficient: X5R; Capacitance: 10µF; Tolerance: ±20%; Value: 10uF, 16V; Supplier 1: Digi-Key; Supplier Part Number 1: 490-7201-2-ND; Category: Capacitors; Ratings: -; Features: -; Lead Style: -; Package / Case: 0603 (1608 Metric); Lead Spacing: -; Applications: General Purpose; Voltage - Rated: 16V; Operating Temperature: -55°C ~ 85°C; Thickness (Max): 0.039" (1.00mm); Mounting Type: Surface Mount, MLCC; RoHS: RoHS Compliant; Size / Dimension: 0.063" L x 0.031" W (1.60mm x 0.80mm); Packaging: Tape & Reel (TR); Height - Seated (Max): -
C419-C421 = Cap_0603: Manufacturer: Murata Electronics North America; Manufacturer Part Number: GRM188R61E106MA73D; Part Description: 10µF ±20% 25V X5R Ceramic Capacitor -55°C ~ 85°C Surface Mount, MLCC 0603 (1608 Metric) 0.063" L x 0.031" W (1.60mm x 0.80mm); Capacitance: 10µF; Tolerance: ±20%; Temperature Coefficient: X5R; Supplier 1: Digi-Key; Supplier Part Number 1: 490-7202-2-ND; Category: Capacitors; RoHS: RoHS Compliant; Packaging: Tape & Reel (TR); Voltage - Rated: 25V; Mounting Type: Surface Mount, MLCC; Operating Temperature: -55°C ~ 85°C; Applications: General Purpose; Ratings: -; Package / Case: 0603 (1608 Metric); Size / Dimension: 0.063" L x 0.031" W (1.60mm x 0.80mm); Height - Seated (Max): -; Thickness (Max): 0.031" (0.80mm); Lead Spacing: -; Features: -; Lead Style: -; value: 10uF, 25V
FR58-FR63 = Ferrite: as FR57 on sheet BoardDiagramEntryConn; Supplier 1: Digi-Key; Supplier Part Number 1: 445-2206-2-ND; Mounting Type: Surface Mount; RoHS: RoHS Compliant; Height (Max): 0.041" (1.05mm); Packaging: Tape & Reel (TR); Category: Filters; Current Rating: 2A; Package / Case: 0805 (2012 Metric); Size / Dimension: 0.079" L x 0.049" W (2.00mm x 1.25mm); Value: 600R, 2A
IC26 IC28 IC30 IC32-IC34 = AP7361: Manufacturer Part Number: AP7361-FGE-7; Manufacturer: Diodes Incorporated; Part Description: IC REG LDO ADJ 1A 8DFN; Regulator Topology: Positive Adjustable; Current - Output: 1A; Current - Limit (Min): 1.1A; Voltage - Dropout (Typical): 0.5V @ 1A; Voltage - Output: 0.8 V ~ 5.5 V; Number of Regulators: 1; Voltage - Input: 2.2 V ~ 6 V; Supplier 1: Digi-Key; Supplier Part Number 1: AP7361-FGE-7DICT-ND; RoHS: RoHS Compliant; Supplier Device Package: U-DFN3030-8; Mounting Type: Surface Mount; Category: Integrated Circuits (ICs); Packaging: Cut Tape (CT); Package / Case: 8-UDFN Exposed Pad; Operating Temperature: -40°C ~ 85°C
IC35 = LP38503TS: Manufacturer Part Number: LP38503TS-ADJ/NOPB; Manufacturer: Texas Instruments; Part Description: IC REG LDO ADJ 3A TO263-5; Regulator Topology: Positive Adjustable; Voltage - Dropout (Typical): 0.42V @ 3A; Number of Regulators: 1; Current - Output: 3A; Voltage - Output: 0.6 V ~ 5 V; Voltage - Input: 2.7 V ~ 5.5 V; Supplier 1: Digi-Key; Category: Integrated Circuits (ICs); RoHS: RoHS Compliant By Exemption; Operating Temperature: -40°C ~ 125°C; Packaging: Tube; Current - Limit (Min): -; Package / Case: TO-263-6, D²Pak (5 Leads + Tab), TO-263BA; Mounting Type: Surface Mount; Supplier Device Package: DDPAK/TO-263-5; Supplier Part Number 1: LP38503TS-ADJ/NOPB-ND
IC36 = SPX3819R2-L/TR: Manufacturer: Exar Corporation; Part Description: Linear Voltage Regulator IC Positive Adjustable 1 Output Adjustable 500mA 8-DFN (2x3); Regulator Topology: Positive Adjustable; Voltage - Output: Adjustable; Current - Output: 500mA; Voltage - Dropout (Typical): 0.34V @ 500mA; Number of Regulators: 1; Voltage - Input: 2.5 V ~ 16 V; Supplier 1: Digi-Key; Manufacturer Part Number 1: SPX3819R2-L/TR; RoHS: RoHS Compliant; Category: Integrated Circuits (ICs); Stock 1: 18339; Pricing 1: 1=0.98, 10=0.855, 25=0.7556, 100=0.6586, 250=0.57328, 500=0.48802, 1000=0.39089 (USD); Packaging: Cut Tape (CT); Part Status: Active; Current - Limit (Min): -; Operating Temperature: -40°C ~ 125°C; Mounting Type: Surface Mount; Package / Case: 8-VFDFN Exposed Pad; Supplier Device Package: 8-DFN (2x3); ComponentLink1URL: https://www.exar.com/content/document.ashx?id=615; ComponentLink1Description: https://www.exar.com/content/document.ashx?id=615; Supplier Part Number 1: 1016-1588-1-ND
IC45 = AP7361: Manufacturer Part Number 1: AP7361-33FGE-7; Manufacturer: Diodes Incorporated; Voltage - Output: 3.3V; Regulator Topology: Positive Fixed; Current - Output: 1A; Voltage - Input: Up to 6V; Current - Limit (Min): 1.1A; Voltage - Dropout (Typical): 0.5V @ 1A; Number of Regulators: 1; Supplier 1: Digi-Key; RoHS: RoHS Compliant; Packaging: Cut Tape (CT); Category: Integrated Circuits (ICs); Operating Temperature: -40°C ~ 85°C; Package / Case: 8-UDFN Exposed Pad; Mounting Type: Surface Mount; Supplier Device Package: U-DFN3030-8; Supplier Part Number 1: AP7361-33FGE-7DICT-ND
L2 = Inductor_0603: Manufacturer: Vishay Dale; Manufacturer Part Number 1: IHLP3232DZER1R0M01; Part Description: FIXED IND 1UH 18A 5.78 MOHM SMD; Tolerance: ±20%; Frequency - Test: 100kHz; DC Resistance (DCR): 5.78 mOhm Max; Inductance: 1µH; Frequency - Self Resonant: 42MHz; Shielding: Shielded; Current - Saturation: 24A; Current Rating: 18A; Type: Molded; value: 1uH; Supplier 1: Digi-Key; Supplier Part Number 1: 541-1371-6-ND; Supplier Device Package: -; Packaging: Digi-Reel®; Height - Seated (Max): 0.158" (4.00mm); RoHS: RoHS Compliant; Size / Dimension: 0.340" L x 0.322" W (8.64mm x 8.18mm); Category: Inductors, Coils, Chokes; Mounting Type: Surface Mount; Material - Core: -; Package / Case: Nonstandard; Q @ Freq: -; Operating Temperature: -55°C ~ 125°C
MECH1-MECH4 = STANDOFF_M-F_THREADED_M3x8x10mm_HEX_5mm dia: STANDOFF M/F MET 5MM HEX 10MM L; Manufacturer: FIX&FASTEN; Manufacturer Part Number 1: FIX-MAE-5TV; Part Description: PCB distance; polyamide; L:5mm; Colour: natural; Øcutout:3mm; Unit: pcs; SuppliedAmount: 1000; MinAmount: 10; Type of spacer: PCB distance; Panel cutout diameter: 3mm; Spanner size: 5.5mm; Internal thread: M3; Thread pitch: 0,5; Supplier 1: TME; Supplier Part Number 1: FIX-MAE-5TV; Category: Plastic Pegs; Weight: 0.145; Multiples: 10; Material: polyamide; Spacer length: 5mm; Price Type: NET
R173 R178 R185 R188 R191 R192 R202 R204 R208 = Res_0402: as R105 on sheet BoardDiagramEntryConn; Value: 0R; Supplier 1: Digi-Key; Supplier Part Number 1: 311-0.0JRTR-ND; Category: Resistors; Temperature Coefficient: -; Features: Moisture Resistant; Supplier Device Package: 0402; Height: 0.016" (0.40mm); Package / Case: 0402 (1005 Metric); Operating Temperature: -55°C ~ 155°C; Size / Dimension: 0.039" L x 0.020" W (1.00mm x 0.50mm); Composition: Thick Film; Packaging: Tape & Reel (TR); Number of Terminations: 2; RoHS: RoHS Compliant
R174 R179 R190 R193 R195 R196 R198 R203 = Res_0402: Manufacturer: Stackpole Electronics Inc; Manufacturer Part Number 1: RMCF0402FT1K00; Part Description: RES SMD 1K OHM 1% 1/16W 0402; Temperature Coefficient: ±100ppm/°C; Power (Watts): 0.063W, 1/16W; Value: 1k, 1%; Supplier 1: Digi-Key; Supplier Part Number 1: RMCF0402FT1K00TR-ND; Resistance (Ohms): 1k; Packaging: Tape & Reel (TR); Category: Resistors; RoHS: RoHS Compliant; Tolerance: ±1%; Height: 0.016" (0.40mm); Number of Terminations: 2; Package / Case: 0402 (1005 Metric); Operating Temperature: -55°C ~ 155°C; Features: -; Composition: Thick Film; Supplier Device Package: 0402; Size / Dimension: 0.039" L x 0.020" W (1.00mm x 0.50mm)
R175 = Res_0402: Manufacturer: Panasonic Electronic Components; Manufacturer Part Number 1: ERA-2AED471X; Power (Watts): 0.063W, 1/16W; Temperature Coefficient: ±25ppm/°C; Resistance (Ohms): 470; Value: 470R, 0.5%; Supplier 1: Digi-Key; Supplier Part Number 1: P470DETR-ND; Tolerance: ±0.5%; Packaging: Tape & Reel (TR); Number of Terminations: 2; Operating Temperature: -55°C ~ 155°C; RoHS: RoHS Compliant; Size / Dimension: 0.039" L x 0.020" W (1.00mm x 0.50mm); Composition: Thin Film; Package / Case: 0402 (1005 Metric); Height: 0.016" (0.40mm); Features: Automotive AEC-Q200; Supplier Device Package: 0402; Category: Resistors
R180 R181 R183 R184 = Res_0402: Part Description: RES SMD 39K OHM 1% 1/16W 0402; Manufacturer Part Number 1: RC0402FR-0739KL; Manufacturer: Yageo; Value: 39k, 1%; Power (Watts): 0.063W, 1/16W; Resistance (Ohms): 39k; Temperature Coefficient: ±100ppm/°C; Supplier 1: Digi-Key; Supplier Part Number 1: 311-39.0KLRCT-ND; Operating Temperature: -55°C ~ 155°C; Height: 0.016" (0.40mm); Supplier Device Package: 0402; Composition: Thick Film; RoHS: RoHS Compliant; Number of Terminations: 2; Part Status: Active; Category: Resistors; Tolerance: ±1%; Package / Case: 0402 (1005 Metric); Features: Moisture Resistant; Size / Dimension: 0.039" L x 0.020" W (1.00mm x 0.50mm); Packaging: Cut Tape (CT)
R182 R197 R206 = Res_0402: Manufacturer Part Number 1: RMCF0402FT806R; Manufacturer: Stackpole Electronics Inc; Part Description: RES SMD 806 OHM 1% 1/16W 0402; Resistance (Ohms): 806; Power (Watts): 0.063W, 1/16W; Temperature Coefficient: ±100ppm/°C; Value: 806R, 1%; Supplier 1: Digi-Key; Supplier Part Number 1: RMCF0402FT806RCT-ND; Category: Resistors; Size / Dimension: 0.039" L x 0.020" W (1.00mm x 0.50mm); Tolerance: ±1%; Features: -; Number of Terminations: 2; RoHS: RoHS Compliant; Operating Temperature: -55°C ~ 155°C; Packaging: Cut Tape (CT); Package / Case: 0402 (1005 Metric); Composition: Thick Film; Height: 0.016" (0.40mm); Supplier Device Package: 0402
R189 = Res_0402: Manufacturer Part Number: RC0402FR-07750RL; Manufacturer: Yageo; Part Description: RES SMD 750 OHM 1% 1/16W 0402; Resistance (Ohms): 750; Power (Watts): 0.063W, 1/16W; Temperature Coefficient: ±100ppm/°C; Value: 750R, 1%; Tolerance: ±1%; Number of Terminations: 2; Supplier Device Package: 0402; Size / Dimension: 0.039" L x 0.020" W (1.00mm x 0.50mm); Height: 0.016" (0.40mm); Composition: Thick Film; Features: Moisture Resistant; Operating Temperature: -55°C ~ 155°C; Package / Case: 0402 (1005 Metric); Supplier 1: Digi-Key; RoHS: RoHS Compliant; Category: Resistors; Packaging: Cut Tape (CT); Supplier Part Number 1: 311-750LRCT-ND
R194 = Res_0402: Manufacturer Part Number: CRCW0402560RFKED; Manufacturer: Vishay Dale; Part Description: RES SMD 560 OHM 1% 1/16W 0402; Resistance (Ohms): 560; Power (Watts): 0.063W, 1/16W; Temperature Coefficient: ±100ppm/°C; RoHS: RoHS Compliant; Packaging: Cut Tape (CT); Composition: Thick Film; Tolerance: ±1%; Number of Terminations: 2; Supplier Device Package: 0402 (1005 Metric); Operating Temperature: -55°C ~ 155°C; Features: Automotive AEC-Q200; Category: Resistors; Supplier Part Number 1: 541-560LCT-ND; Package / Case: 0402 (1005 Metric); Supplier 1: Digi-Key; Height: 0.016" (0.40mm); Size / Dimension: 0.039" L x 0.020" W (1.00mm x 0.50mm)
R199 R200 = Res_0402: Manufacturer: Stackpole Electronics Inc; Manufacturer Part Number 1: RMCF0402FT1K00; Part Description: RES SMD 1K OHM 1% 1/16W 0402; Value: 1k, 1%; Resistance (Ohms): 1k; Temperature Coefficient: ±100ppm/°C; Power (Watts): 0.063W, 1/16W; Supplier 1: Digi-Key; Supplier Part Number 1: RMCF0402FT1K00TR-ND; Packaging: Tape & Reel (TR); Category: Resistors; RoHS: RoHS Compliant; Tolerance: ±1%; Height: 0.016" (0.40mm); Number of Terminations: 2; Package / Case: 0402 (1005 Metric); Operating Temperature: -55°C ~ 155°C; Features: -; Composition: Thick Film; Supplier Device Package: 0402; Size / Dimension: 0.039" L x 0.020" W (1.00mm x 0.50mm)
R205 R207 R211 = Res_0402: as R112 on sheet BoardDiagramEntryConn; Value: 10k, 1%; Supplier 1: Digi-Key; Supplier Part Number 1: 311-10.0KLRTR-ND; Resistance (Ohms): 10k; Packaging: Tape & Reel (TR); RoHS: RoHS Compliant; Package / Case: 0402 (1005 Metric); Tolerance: ±1%; Operating Temperature: -55°C ~ 155°C; Size / Dimension: 0.039" L x 0.020" W (1.00mm x 0.50mm); Number of Terminations: 2; Category: Resistors; Height: 0.016" (0.40mm); Supplier Device Package: 0402; Features: Moisture Resistant; Composition: Thick Film
R209 = Res_0402: Part Description: RES SMD 39K OHM 1% 1/16W 0402; Manufacturer Part Number 1: RC0402FR-0739KL; Manufacturer: Yageo; Power (Watts): 0.063W, 1/16W; Temperature Coefficient: ±100ppm/°C; Value: 39k, 1%; Supplier 1: Digi-Key; Supplier Part Number 1: 311-39.0KLRCT-ND; Operating Temperature: -55°C ~ 155°C; Height: 0.016" (0.40mm); Supplier Device Package: 0402; Composition: Thick Film; RoHS: RoHS Compliant; Number of Terminations: 2; Part Status: Active; Category: Resistors; Tolerance: ±1%; Resistance (Ohms): 39k; Package / Case: 0402 (1005 Metric); Features: Moisture Resistant; Size / Dimension: 0.039" L x 0.020" W (1.00mm x 0.50mm); Packaging: Cut Tape (CT)
R210 = Res_0402: Part Description: RES SMD 23.2K OHM 1% 1/16W 0402; Manufacturer: Yageo; Manufacturer Part Number 1: RC0402FR-0723K2L; Power (Watts): 0.063W, 1/16W; Temperature Coefficient: ±100ppm/°C; Value: 23.2k, 1%; Supplier 1: Digi-Key; Supplier Part Number 1: YAG3066CT-ND; Part Status: Active; Operating Temperature: -55°C ~ 155°C; Package / Case: 0402 (1005 Metric); Packaging: Cut Tape (CT); Number of Terminations: 2; Height: 0.016" (0.40mm); Tolerance: ±1%; Composition: Thick Film; Supplier Device Package: 0402; Size / Dimension: 0.039" L x 0.020" W (1.00mm x 0.50mm); Resistance (Ohms): 23.2k; Category: Resistors; Features: Moisture Resistant; RoHS: RoHS Compliant